# EAGLE design leds-and-button (EAGLE 7.4.0)
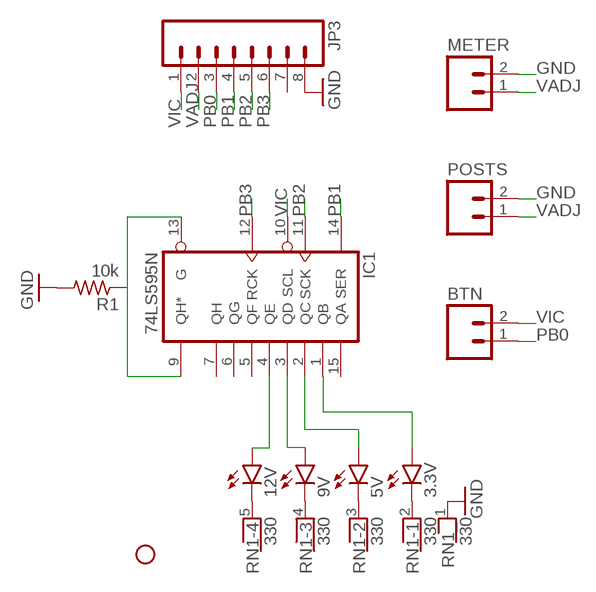
[diagram p0: schematic, sheet 1]

## Parts
3.3V  LED3MM  [LED3MM]
5V  LED3MM  [LED3MM]
9V  LED3MM  [LED3MM]
12V  LED3MM  [LED3MM]
BTN  M02PTH  [1X02]
IC1  74LS595N  [DIL16]
JP2  STAND-OFF  [STAND-OFF]
JP3  M081X08  [1X08]
METER  M02PTH  [1X02]
POSTS  M02PTH  [1X02]
R1  10k  R-US_0204/2V  [0204V]
RN1  330  RNX5  [RN-6]

## Nets
GND: JP3.8 METER.2 POSTS.2 R1.2 RN1.1
N$2: 12V.K(C) RN1.5
N$3: 9V.K(C) RN1.4
N$5: 12V.A IC1.4(QE)
N$6: 9V.A IC1.3(QD)
N$7: 5V.A IC1.2(QC)
N$8: 5V.K(C) RN1.3
N$9: 3.3V.K(C) RN1.2
N$11: IC1.9(QH*) IC1.13(G) R1.1
N$13: 3.3V.A IC1.1(QB)
PB0: BTN.1 JP3.3
PB1: IC1.14(SER) JP3.4
PB2: IC1.11(SCK) JP3.5
PB3: IC1.12(RCK) JP3.6
VADJ: JP3.2 METER.1 POSTS.1
VIC: BTN.2 IC1.10(SCL) JP3.1
Unconnected: IC1.5(QF) IC1.6(QG) IC1.7(QH) IC1.15(QA) JP3.7 RN1.6

## Power pins joined to a net without a drawn wire
GND: IC1.8(GND)
VADJ: IC1.16(VCC)

## Library data of the parts
3.3V 5V 9V 12V = SparkFun-LED:LED: LEDs Standard schematic elements and footprints for 5mm, 3mm, 1206, and 0603 sized LEDs. 5mm - Spark Fun Electronics SKU : COM-00529 (and others)
BTN METER POSTS = SparkFun:M02: Header 2 Standard 2-pin 0.1" header. Use with straight break away headers (SKU : PRT-00116), right angle break away headers (PRT-00553), swiss pins (PRT-00743), machine pins (PRT-00117), and female headers (PRT-00115). Molex polarized connector foot print use with SKU : PRT-08233 with associated crimp pins and housings.
IC1 = 74xx-us:74*595: 8-bit SHIFT REGISTER, output latch
JP2 = SparkFun:STAND-OFF: Stand Off This is the mechanical footprint for a #4 phillips button head screw. Use the keepout ring to avoid running the screw head into surrounding components. SKU : PRT-00447
JP3 = SparkFun:M08: Header 8 Standard 8-pin 0.1" header. Use with straight break away headers (SKU : PRT-00116), right angle break away headers (PRT-00553), swiss pins (PRT-00743), machine pins (PRT-00117), and female headers (PRT-00115).
R1 = resistor:R-US_: RESISTOR, American symbol
RN1 = resistor-net:RNX5: RESISTOR NETWORK; OC_FARNELL: unknown; OC_NEWARK: unknown

## Net classes
1 power: width 0.61 mm

## Board
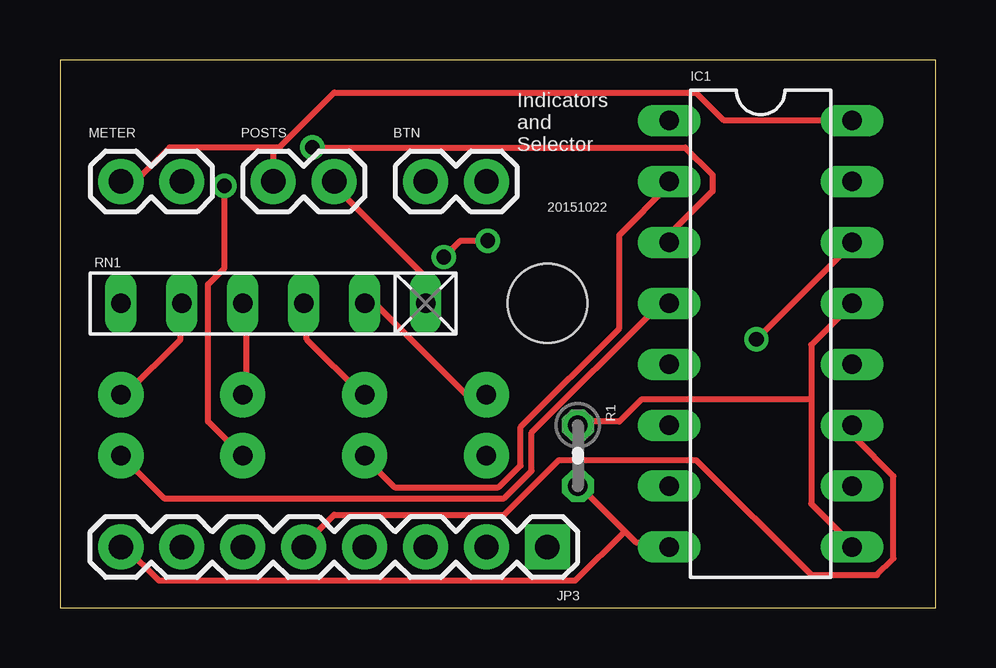
[diagram p1: board, top side]
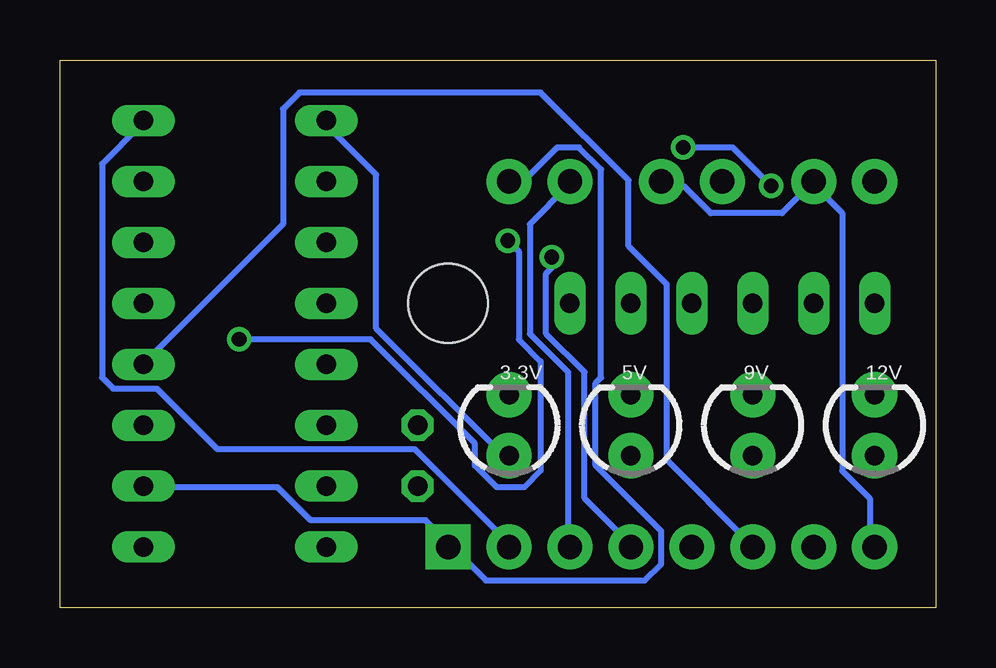
[diagram p2: board, bottom side, seen from below]

Size 36.5 x 22.85 mm. Coordinates in mm from the lower left corner, seen from the top.
Outline: 0,0 36.5,0 36.5,22.85 0,22.85 0,0
Copper layers (1*16): Top 0.035mm / dielectric 1.5mm / Bottom 0.035mm
Design rules "default": minimum track width 10mil, minimum drill 24mil, track to track 8mil, track to pad 8mil, pad to pad 8mil, via to via 8mil, smd to smd 8mil, copper to edge 40mil, drill to drill 8mil, minimum pad ring 10mil, minimum via ring 8mil, stop-mask expansion 4mil, vias tented up to drill 0mil, thermal gap 10mil

### Footprints (pad centres in the part's own frame; a part is rotated, then mirrored left to right if it is on the bottom)
LED3MM = drill 0.813 pad 1.88: A -1.27,0; K 1.27,0
1X02 = drill 1.016 pad 1.88: 1 0,0; 2 2.54,0
DIL16 = drill 0.813 long: 1 -8.89,-3.81; 2 -6.35,-3.81; 3 -3.81,-3.81; 4 -1.27,-3.81; 5 1.27,-3.81; 6 3.81,-3.81; 7 6.35,-3.81; 8 8.89,-3.81; 9 8.89,3.81; 10 6.35,3.81; 11 3.81,3.81; 12 1.27,3.81; 13 -1.27,3.81; 14 -3.81,3.81; 15 -6.35,3.81; 16 -8.89,3.81
STAND-OFF = hole 3.302: 0,0
1X08 = drill 1.016 pad 1.88 square: 1 0,0 | drill 1.016 pad 1.88: 2 2.54,0; 3 5.08,0; 4 7.62,0; 5 10.16,0; 6 12.7,0; 7 15.24,0; 8 17.78,0
0204V = drill 0.813 octagon: 1 -1.27,0; 2 1.27,0
RN-6 = drill 0.813 long: 1 -6.35,0; 2 -3.81,0; 3 -1.27,0; 4 1.27,0; 5 3.81,0; 6 6.35,0

### Placement (x,y rotation side)
3.3V  17.78,7.62 90 bottom
5V  12.7,7.62 90 bottom
9V  7.62,7.62 90 bottom
12V  2.54,7.62 90 bottom
BTN  15.24,17.78 0 top
IC1  29.21,11.43 270 top
JP2  20.32,12.7 0 top
JP3  20.32,2.54 180 top
METER  2.54,17.78 0 top
POSTS  8.89,17.78 0 top
R1  21.59,6.35 270 top
RN1  8.89,12.7 180 top

### Tracks (layer width: path | path; a pad name or v marks a point on that pad's centre or on a via)
GND
  Top 0.254: RN1.1 15.09,12.8 15.09,13.95 11.43,17.6 POSTS.2 | 23.55,3.2 21.72,5.03 R1.2 | 23.55,3.2 24,2.74 25.38,2.74 IC1.8 | 23.55,3.2 21.49,1.14 4.12,1.14 2.74,2.52 JP3.8
  Bottom 0.254: JP3.8 2.74,2.74 2.74,4.57 3.89,5.71 3.89,16.46 5.03,17.6 METER.2 6.4,16.46 9.37,16.46 10.52,17.6 11.43,17.6 POSTS.2
N$2
  Top 0.254: RN1.5 5.03,12.57 5.03,11.2 2.74,8.91 12V.K
N$3
  Top 0.254: RN1.4 7.77,12.57 7.77,8.91 9V.K
N$5
  Top 0.254: IC1.4 25.38,12.57 24.92,12.57 19.66,7.32 19.66,5.71 18.52,4.57 4.34,4.57 2.74,6.17 12V.A
N$6  (via drill 0.61)
  Top 0.254: v10.52,19.2 26.06,19.2 27.2,18.06 27.2,17.37 25.6,15.77 25.6,15.32 IC1.3 | v6.86,17.6 6.86,14.17 6.17,13.49 6.17,7.77 7.54,6.4 9V.A
  Bottom 0.254: v10.52,19.2 8.46,19.2 v6.86,17.6
N$7
  Top 0.254: IC1.2 25.38,17.6 23.32,15.54 23.32,11.66 19.2,7.54 19.2,5.94 18.29,5.03 13.95,5.03 12.8,6.17 5V.A
N$8
  Top 0.254: RN1.3 10.29,12.57 10.29,11.2 12.57,8.91 5V.K
N$9
  Top 0.254: RN1.2 12.8,12.57 13.26,12.57 16.92,8.91 17.6,8.91 3.3V.K
N$11
  Top 0.254: 31.32,8.69 31.32,10.97 32.92,12.57 IC1.13 | 31.32,8.69 31.32,4.34 32.92,2.74 IC1.9 | 31.32,8.69 24.23,8.69 23.32,7.77 21.72,7.77 R1.1
N$13
  Bottom 0.254: IC1.1 25.38,20.12 23.32,18.06 23.32,11.66 17.83,6.17 3.3V.A
PB0
  Bottom 0.254: JP3.3 15.32,2.74 15.32,9.83 16.92,11.43 16.92,16 15.32,17.6 BTN.1
PB1  (via drill 0.61)
  Top 0.254: v29.03,11.2 32.92,15.09 IC1.14 | v17.83,15.32 16.69,15.32 v16,14.63
  Bottom 0.254: v29.03,11.2 23.55,11.2 19.2,6.86 19.2,5.94 18.29,5.03 17.14,5.03 16.46,5.71 16.46,10.29 17.37,11.2 17.37,14.86 v17.83,15.32 | v16,14.63 16,14.17 16.23,13.95 16.23,11.43 14.63,9.83 14.63,4.57 12.8,2.74 JP3.4
PB2
  Top 0.254: IC1.11 33.15,7.54 33.15,7.09 34.75,5.49 34.75,2.06 34.06,1.37 31.32,1.37 26.52,6.17 20.8,6.17 18.52,3.89 11.43,3.89 10.29,2.74 JP3.5
PB3
  Bottom 0.254: IC1.12 32.92,10.29 27.2,16 27.2,20.8 26.52,21.49 16.46,21.49 12.8,17.83 12.8,15.09 11.2,13.49 11.2,6.17 7.77,2.74 JP3.6
VADJ
  Top 0.254: 9.14,19.2 8.91,18.97 8.91,17.83 POSTS.1 | 9.14,19.2 11.43,21.49 26.52,21.49 27.66,20.34 32.92,20.34 IC1.16 | 9.14,19.2 4.57,19.2 3.2,17.83 2.74,17.83 METER.1
  Bottom 0.254: JP3.2 17.83,2.74 21.72,6.63 29.95,6.63 32.46,9.14 34.29,9.14 34.75,9.6 34.75,18.52 33.15,20.12 IC1.16
VIC
  Bottom 0.254: IC1.10 32.92,5.03 27.43,5.03 26.06,3.66 21.26,3.66 20.34,2.74 JP3.1 20.12,2.52 18.75,1.14 12.12,1.14 11.43,1.83 11.43,3.2 14.17,5.94 14.17,9.37 13.95,9.6 13.95,18.29 14.86,19.2 15.77,19.2 17.14,17.83 17.6,17.83 BTN.2

### Text on the board
tPlace: Indicators / and / Selector | 20151022